# EAGLE design RemoteR2.0 (EAGLE 9.6.2)
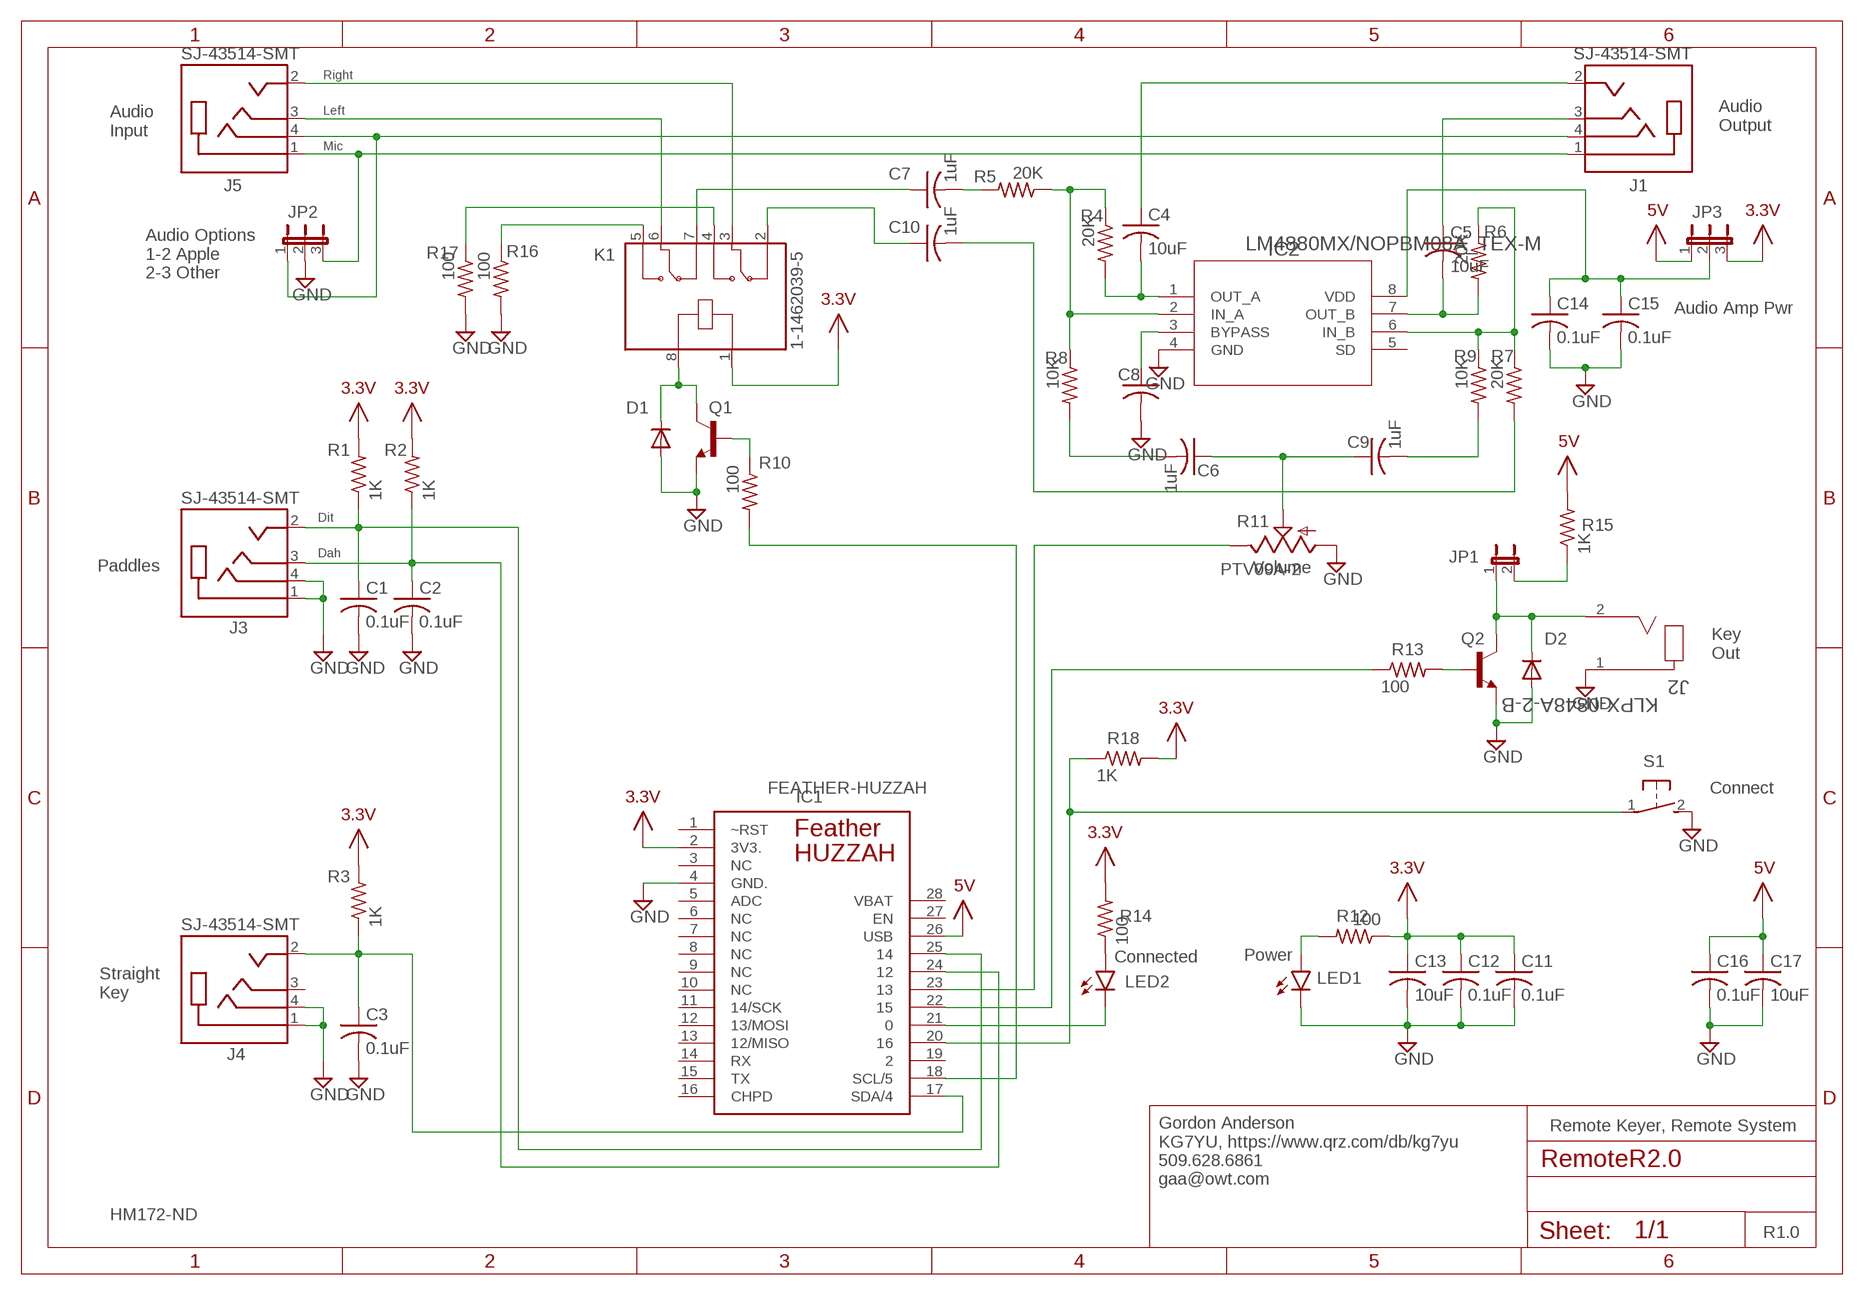
[diagram p0: schematic, sheet 1]

## Parts
C1  0.1uF  C-USC0805  [C0805]
C2  0.1uF  C-USC0805  [C0805]
C3  0.1uF  C-USC0805  [C0805]
C4  10uF  C-USC1206  [C1206]
C5  10uF  C-USC1206  [C1206]
C6  1uF  C-USC0805  [C0805]
C7  1uF  C-USC0805  [C0805]
C8  C-USC0805  [C0805]
C9  1uF  C-USC0805  [C0805]
C10  1uF  C-USC0805  [C0805]
C11  0.1uF  C-USC0805  [C0805]
C12  0.1uF  C-USC0805  [C0805]
C13  10uF  C-USC0805  [C0805]
C14  0.1uF  C-USC0805  [C0805]
C15  0.1uF  C-USC0805  [C0805]
C16  0.1uF  C-USC0805  [C0805]
C17  10uF  C-USC0805  [C0805]
D1  DIODE-SOD323-R  [SOD323-R]
D2  DIODE-SOD323-R  [SOD323-R]
IC1  FEATHER-HUZZAH  [FEATHER-HUZZAH]
IC2  LM4880MX/NOPBM08A_TEX-M  [M08A_TEX-M]
J1  SJ-43514-SMT  [CUI_SJ-43514-SMT]
J2  KLPX-0848A-2-B  [KLPX-0848A-2-B_KYC]
J3  SJ-43514-SMT  [CUI_SJ-43514-SMT]
J4  SJ-43514-SMT  [CUI_SJ-43514-SMT]
J5  SJ-43514-SMT  [CUI_SJ-43514-SMT]
JP1  JP1E  [JP1]
JP2  JP2E  [JP2]
JP3  JP2E  [JP2]
K1  1-1462039-5  [RELAY_1-1462039-5]
LED1  LED5MM  [LED5MM]
LED2  LED5MM  [LED5MM]
Q1  MMBT2369LT1-NPN-SOT23-BEC  [SOT23-BEC]
Q2  MMBT2369LT1-NPN-SOT23-BEC  [SOT23-BEC]
R1  1K  R-US_R0805  [R0805]
R2  1K  R-US_R0805  [R0805]
R3  1K  R-US_R0805  [R0805]
R4  20K  R-US_R0805  [R0805]
R5  20K  R-US_R0805  [R0805]
R6  20K  R-US_R0805  [R0805]
R7  20K  R-US_R0805  [R0805]
R8  10K  R-US_R0805  [R0805]
R9  10K  R-US_R0805  [R0805]
R10  100  R-US_R0805  [R0805]
R11  PTV09A-2  [PTV09A-2]
R12  100  R-US_R0805  [R0805]
R13  100  R-US_R0805  [R0805]
R14  100  R-US_R0805  [R0805]
R15  1K  R-US_R0805  [R0805]
R16  100  R-US_R1206  [R1206]
R17  100  R-US_R1206  [R1206]
R18  1K  R-US_R0805  [R0805]
S1  31-XX  [B3F-31XX]

## Nets
3.3V: C11.1 C12.1 C13.1 IC1.2(3V3.) JP3.3 K1.1 R1.2 R2.2 R3.2 R12.1 R14.2 R18.2
5V: C16.1 C17.1 IC1.26(USB) JP3.1 R15.2
GND: C1.2 C2.2 C3.2 C8.2 C11.2 C12.2 C13.2 C14.2 C15.2 C16.2 C17.2 D1.A D2.A IC1.4(GND.) IC2.4(GND) J2.1 J3.1(SLEEVE) J3.4(RING2) J4.1(SLEEVE) J4.4(RING2) JP2.2 LED1.K(C) Q1.E Q2.E R11.1(A) R16.2 R17.2 S1.2(S)
N$1: Q2.B R13.2
N$2: C2.1 IC1.24 J3.3(RING1) R2.1
N$3: C3.1 IC1.17(SDA/4) J4.2(TIP) R3.1
N$4: C1.1 IC1.25 J3.2(TIP) R1.1
N$5: C9.2 R9.2
N$6: C4.2 IC2.1(OUT_A) R4.2
N$7: IC2.2(IN_A) R4.1 R5.1 R8.1
N$8: C8.1 IC2.3(BYPASS)
N$9: C7.1 K1.7
N$10: C6.2 R8.2
N$11: C5.2 IC2.7(OUT_B) R6.2
N$12: IC2.6(IN_B) R6.1 R7.1 R9.1
N$13: C6.1 C9.1 R11.2(S)
N$14: Q1.B R10.1
N$15: C4.1 J1.2(TIP)
N$16: C5.1 J1.3(RING1)
N$17: J5.3(RING1) K1.6
N$18: J5.2(TIP) K1.3
N$19: J1.1(SLEEVE) J5.1(SLEEVE) JP2.3
N$20: C7.2 R5.2
N$21: C10.1 K1.2
N$22: C10.2 R7.2
N$23: LED1.A R12.2
N$24: LED2.A R14.1
N$25: IC1.21 LED2.K(C)
N$26: IC1.23 R11.3(E)
N$27: IC1.22 R13.1
N$28: IC1.18(SCL/5) R10.2
N$29: JP1.2 R15.1
N$30: K1.4 R17.1
N$31: K1.5 R16.1
N$32: IC1.20 R18.1 S1.1(P)
N$33: C14.1 C15.1 IC2.8(VDD) JP3.2
N$34: J1.4(RING2) J5.4(RING2) JP2.1
RELAY-: D2.C J2.2 JP1.1 Q2.C
RELAY-1: D1.C K1.8 Q1.C
Unconnected: IC1.1(~RST) IC1.3(NC) IC1.5(ADC) IC1.6(NC) IC1.7(NC) IC1.8(NC) IC1.9(NC) IC1.10(NC) IC1.11(14/SCK) IC1.12(13/MOSI) IC1.13(12/MISO) IC1.14(RX) IC1.15(TX) IC1.19 IC1.27(EN) IC2.5(SD) J4.3(RING1)

## Notes on the sheet
- Right
- Left
- Audio
  Output
- Audio
  Input
- Mic
- Audio Options
  1-2 Apple
  2-3 Other
- Audio Amp Pwr
- Dit
- Dah
- Paddles | Volume
- Key
  Out
- Connect
- Connected | Power
- Straight
  Key
- Remote Keyer, Remote System
- Gordon Anderson
  KG7YU, https://www.qrz.com/db/kg7yu
  509.628.6861
  gaa@owt.com
- HM172-ND
- R1.0

## Power pins joined to a net without a drawn wire
CHPD: IC1.16(CHPD)
VBAT: IC1.28(VBAT)

## Library data of the parts
C1-C17 = rcl:C-US: CAPACITOR, American symbol; SPICEPREFIX: C
D1 D2 = diode:DIODE-: DIODE
IC1 = GAAextensions:FEATHER-HUZZAH
IC2 = GAAextensions:LM4880MX/NOPB; COPYRIGHT: Copyright (C) 2021 Ultra Librarian. All rights reserved.; DIGI-KEY_PART_NUMBER_1: 296-35421-1-ND; DIGI-KEY_PART_NUMBER_2: 296-35421-2-ND; DIGI-KEY_PART_NUMBER_3: 296-35421-6-ND; MANUFACTURER_PART_NUMBER: LM4880MX/NOPB; MFR_NAME: Texas Instruments
J1 J3-J5 = SJ-43514-SMT:SJ-43514-SMT: 4 conductor 3.5 mm Surface Mount Audio Jack; CUI_PURCHASE_URL: https://www.cuidevices.com/product/interconnect/connectors/audio-connectors/jacks/sj-4351x-smt-series?utm_source=snapeda.com&utm_medium=referral&utm_campaign=snapedaBOM; DESCRIPTION: 3.5 mm, 4 Conductors, Right Angle, Surface Mount (SMT), Audio Jack Connector; MF: CUI Devices; MP: SJ-43514-SMT-TR; PACKAGE: None; PURCHASE-URL: https://pricing.snapeda.com/search/part/SJ-43514-SMT-TR/?ref=eda
J2 = GAAextensions:KLPX-0848A-2-B; COPYRIGHT: Copyright (C) 2021 Ultra Librarian. All rights reserved.; DIGI-KEY_PART_NUMBER_1: 2092-KLPX-0848A-2-B-ND; MANUFACTURER_PART_NUMBER: KLPX-0848A-2-B; MFR_NAME: KYCON, INC.
JP1 = jumper:JP1E: JUMPER
JP2 JP3 = jumper:JP2E: JUMPER
K1 = 1-1462039-5:1-1462039-5: Signal Relay 3VDC 2A DPDT( (10mm 6mm 5.65mm)) THT Automotive; COMMENT: 1-1462039-5; DESCRIPTION: Signal Relay 3VDC 2A DPDT( (10mm 6mm 5.65mm)) THT Automotive; DIGI-KEY_PART_NUMBER: PB1167-ND; EU_ROHS_COMPLIANCE: Compliant; MF: TE Connectivity; MP: 1-1462039-5; PACKAGE: None; PURCHASE-URL: https://pricing.snapeda.com/search/part/1-1462039-5/?ref=eda
LED1 LED2 = led:LED: LED OSRAM: - CHIPLED LG R971, LG N971, LY N971, LG Q971, LY Q971, LO R971, LY R971 LH N974, LH R974 LS Q976, LO Q976, LY Q976 LO Q996 - Hyper CHIPLED LW Q18S LB Q993, LB Q99A, LB R99A - SideLED LS A670, LO A670, LY A670, LG A670, LP A670 LB A673, LV A673, LT A673, LW A673 LH A674 LY A675 LS A676, LA A676, LO A676, LY A676, LW A676 LS A679, LY A679, LG A679 - Hyper Micro SIDELED® LS Y876, LA Y876, LO Y876, LY Y876 LT Y87S - SmartLED LW L88C, LW L88S LB L89C, LB L89S, LG L890 LS L89K, LO L89K, LY L89K LS L896, LA L896, LO L896, LY L896 - TOPLED LS T670, LO T670, LY T670, LG T670, LP T670 LSG T670, LSP T670, LSY T670, LOP T670, LYG T670 LG T671, LOG T671, LSG T671 LB T673, LV T673, LT T673, LW T673 LH T674 LS T676, LA T676, LO T676, LY T676, LB T676, LH T676, LSB T676, LW T676 LB T67C, LV T67C, LT T67C, LS T67K, LO T67K, LY T67K, LW E67C LS E67B, LA E67B, LO E67B, LY E67B, LB E67C, LV E67C, LT E67C LW T67C LS T679, LY T679, LG T679 LS T770, LO T770, LY T770, LG T770, LP T770 LB T773, LV T773, LT T773, LW T773 LH T774 LS E675, LA E675, LY E675, LS T675 LS T776, LA T776, LO T776, LY T776, LB T776 LHGB T686 LT T68C, LB T68C - Hyper Mini TOPLED® LB M676 - Mini TOPLED Santana® LG M470 LS M47K, LO M47K, LY M47K Source: http://www.osram.convergy.de LUXEON: - LUMILED® LXK2-PW12-R00, LXK2-PW12-S00, LXK2-PW14-U00, LXK2-PW14-V00 LXK2-PM12-R00, LXK2-PM12-S00, LXK2-PM14-U00 LXK2-PE12-Q00, LXK2-PE12-R00, LXK2-PE12-S00, LXK2-PE14-T00, LXK2-PE14-U00 LXK2-PB12-K00, LXK2-PB12-L00, LXK2-PB12-M00, LXK2-PB14-N00, LXK2-PB14-P00, LXK2-PB14-Q00 LXK2-PR12-L00, LXK2-PR12-M00, LXK2-PR14-Q00, LXK2-PR14-R00 LXK2-PD12-Q00, LXK2-PD12-R00, LXK2-PD12-S00 LXK2-PH12-R00, LXK2-PH12-S00 LXK2-PL12-P00, LXK2-PL12-Q00, LXK2-PL12-R00 Source: www.luxeon.com KINGBRIGHT: KA-3528ASYC Source: www.kingbright.com
Q1 Q2 = GAAextensions:*-NPN-: NPN Transistror
R1-R10 R12-R18 = rcl:R-US_: RESISTOR, American symbol; SPICEPREFIX: R
R11 = GAAextensions:PTV09A-2
S1 = switch-omron:31-XX: OMRON SWITCH; MPN: B3F-3100; OC_FARNELL: 959704; OC_NEWARK: 36M3582

## Board
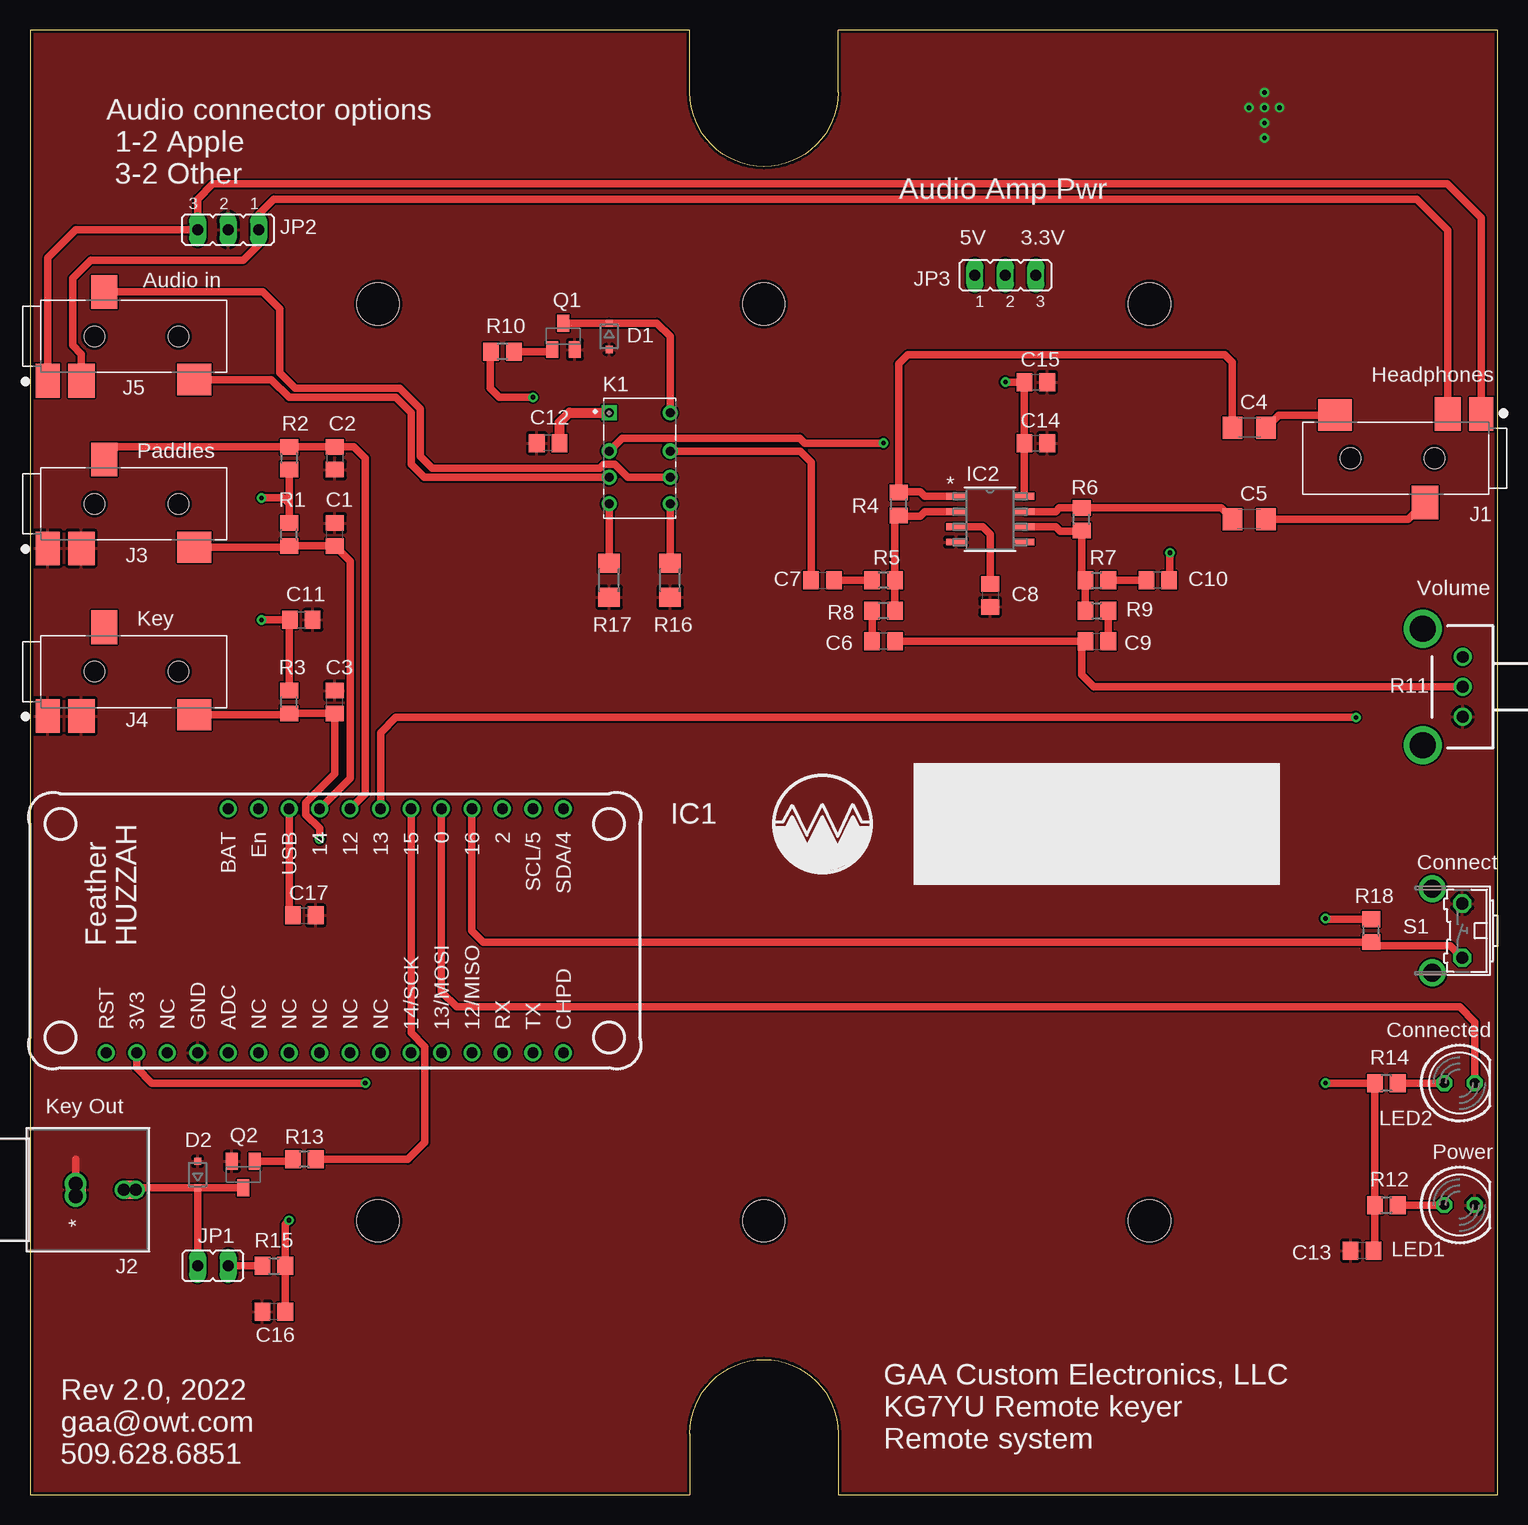
[diagram p1: board, top side]
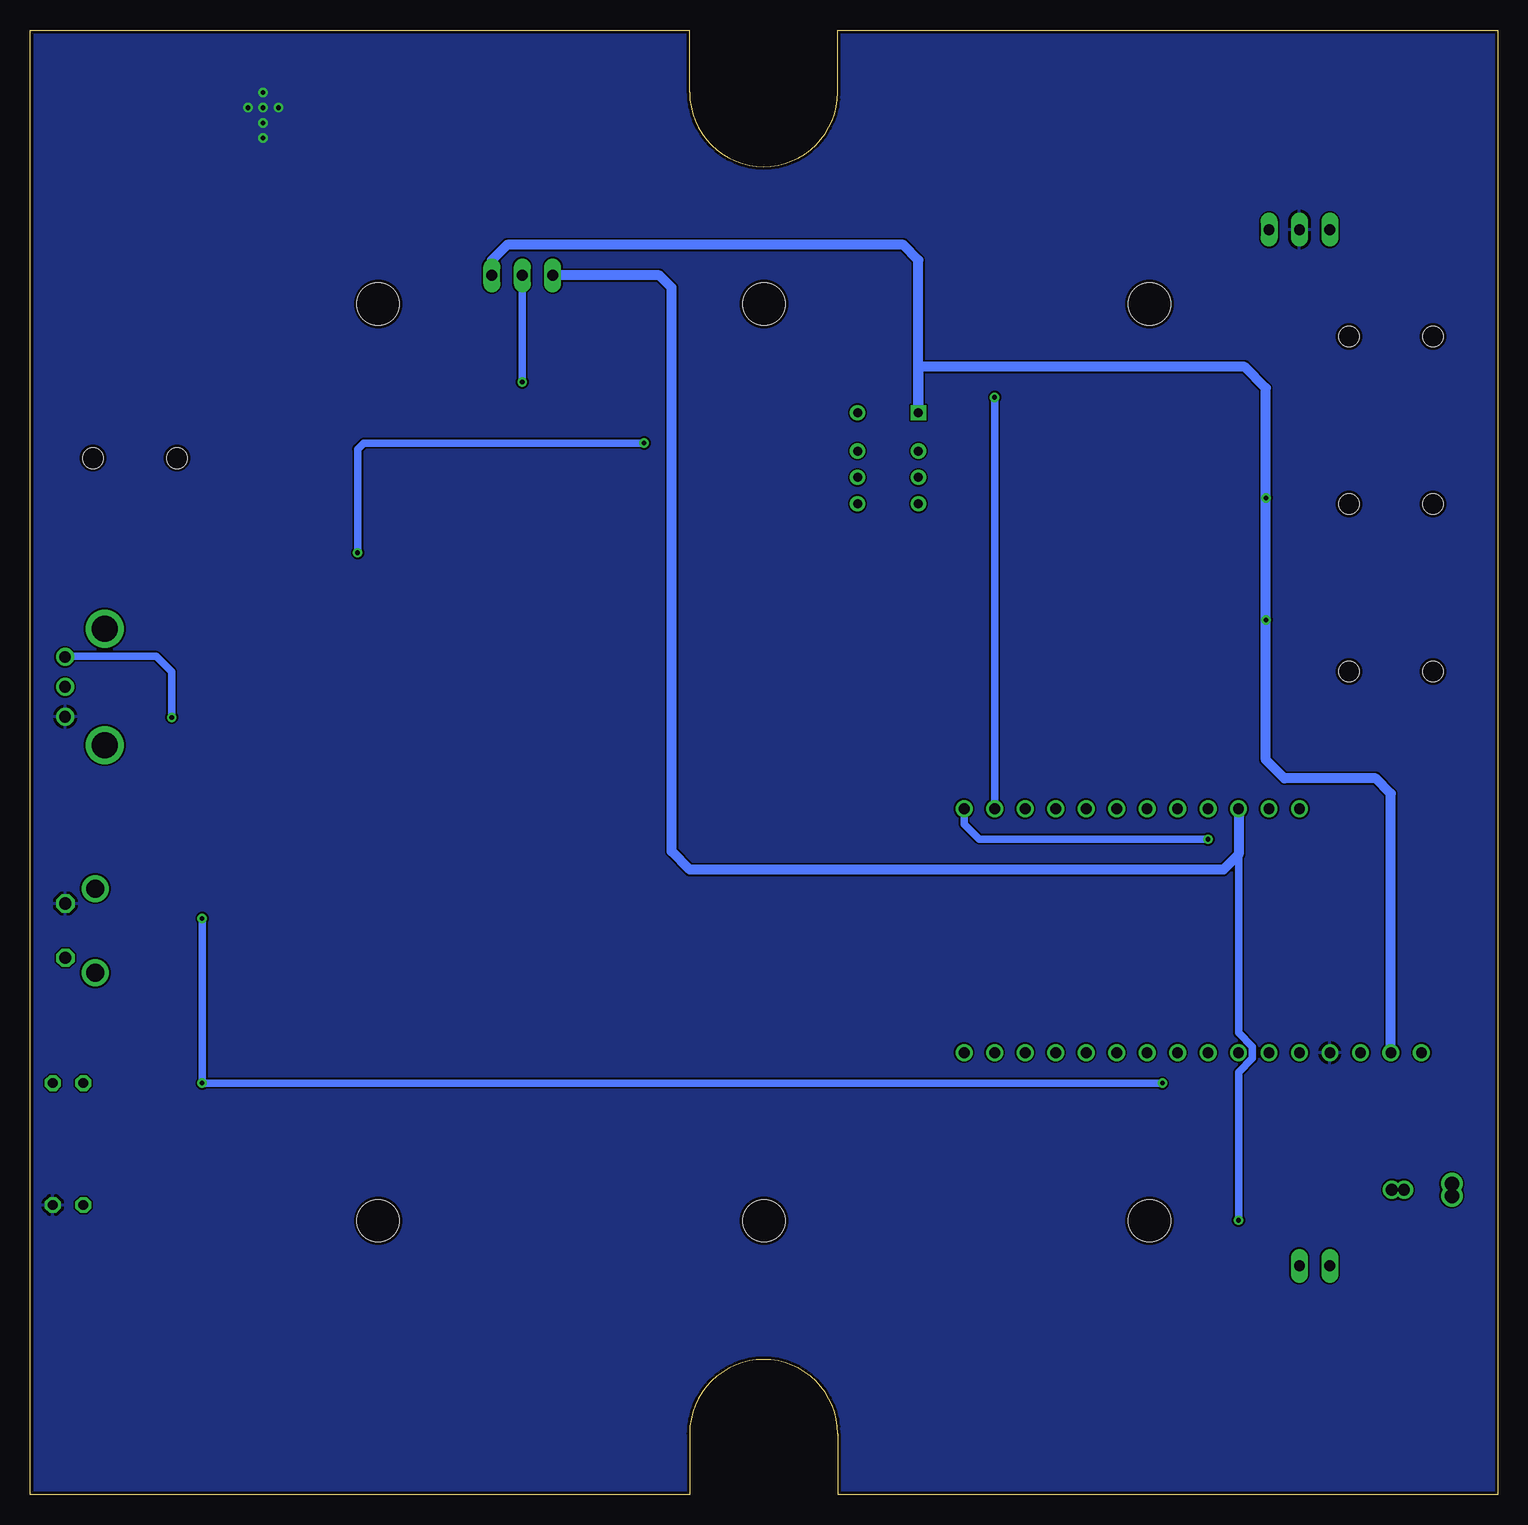
[diagram p2: board, bottom side, seen from below]

Size 122.3 x 122.05 mm. Coordinates in mm from the lower left corner, seen from the top.
Outline: 0,0 54.99,0 54.99,5.08 arc-180 67.33,5.08 67.33,0 122.3,0 122.3,122.05 67.33,122.05 67.33,116.84 arc-180 54.99,116.84 54.99,122.05 0,122.05 0,0
Copper layers (1*16): Top 0.035mm / dielectric 1.5mm / Bottom 0.035mm
Design rules "default *": minimum track width 6mil, minimum drill 0.35mm, track to track 6mil, track to pad 6mil, pad to pad 6mil, via to via 6mil, smd to smd 6mil, copper to edge 10mil, drill to drill 6mil, minimum pad ring 10mil, minimum via ring 8mil, stop-mask expansion 4mil, vias tented up to drill 50mil, thermal gap 10mil
Holes 3.51 mm at 29.01,22.81 61.14,22.81 93.29,22.81 29.01,99.21 61.14,99.21 93.29,99.21

### Footprints (pad centres in the part's own frame; a part is rotated, then mirrored left to right if it is on the bottom)
C0805 = smd 1.3 x 1.5: 1 -0.95,0; 2 0.95,0
C1206 = smd 1.6 x 1.8: 1 -1.4,0; 2 1.4,0
SOD323-R = smd 0.6 x 0.6: A 1.1,0; C -1.1,0
FEATHER-HUZZAH = drill 0.9: 1 -10.16,17.78; 2 -10.16,15.24; 3 -10.16,12.7; 4 -10.16,10.16; 5 -10.16,7.62; 6 -10.16,5.08; 7 -10.16,2.54; 8 -10.16,0; 9 -10.16,-2.54; 10 -10.16,-5.08; 11 -10.16,-7.62; 12 -10.16,-10.16; 13 -10.16,-12.7; 14 -10.16,-15.24; 15 -10.16,-17.78; 16 -10.16,-20.32; 17 10.16,-20.32; 18 10.16,-17.78; 19 10.16,-15.24; 20 10.16,-12.7; 21 10.16,-10.16; 22 10.16,-7.62; 23 10.16,-5.08; 24 10.16,-2.54; 25 10.16,0; 26 10.16,2.54; 27 10.16,5.08; 28 10.16,7.62
M08A_TEX-M = smd 1.664 x 0.559: 1 -2.826,1.905; 2 -2.826,0.635; 3 -2.826,-0.635; 4 -2.826,-1.905; 5 2.826,-1.905; 6 2.826,-0.635; 7 2.826,0.635; 8 2.826,1.905
CUI_SJ-43514-SMT = smd 2 x 2.8: 1 -7.15,-3.7 | smd 2.8 x 2.6: 2 5.05,-3.6 | smd 2.2 x 2.8: 3 -2.45,3.7; 4 -4.35,-3.7 | hole 1.7: -3.25,0; 3.75,0
KLPX-0848A-2-B_KYC = smd 2.718 x 1.702: 1 0,0 | smd 1.499 x 2.515: 2 0,-4.5 | drill 1.194 pad 1.194: S_1_H1 0.508,0; S_1_H2 -0.508,0 | drill 0.991 pad 0.991: S_2_H1 0,-3.988; S_2_H2 0,-5.004
JP1 = drill 0.914 long: 1 0,-1.27; 2 0,1.27
JP2 = drill 0.914 long: 1 -2.54,0; 2 0,0; 3 2.54,0
RELAY_1-1462039-5 = drill 0.75 square: 1 -2.54,3.8 | drill 0.75: 2 -2.54,0.6; 3 -2.54,-1.6; 4 -2.54,-3.8; 5 2.54,-3.8; 6 2.54,-1.6; 7 2.54,0.6; 8 2.54,3.8
LED5MM = drill 0.813 octagon: A -1.27,0; K 1.27,0
SOT23-BEC = smd 1 x 1.4: B -0.95,-1.1; C 0,1.1; E 0.95,-1.1
R0805 = smd 1.3 x 1.5: 1 -0.95,0; 2 0.95,0
PTV09A-2 = drill 0.991: 1 -2.489,0; 2 0,0; 3 2.489,0 | drill 2.159: S1 -4.851,3.302; S2 4.851,3.302
R1206 = smd 1.6 x 1.803: 1 -1.422,0; 2 1.422,0
B3F-31XX = drill 1.016 octagon: 1 -2.261,-1.245; 2 2.261,-1.245 | drill 1.499 pad 2.159: 3 -3.505,1.245; 4 3.505,1.245

### Placement (x,y rotation side)
C1  25.4,80.01 90 top
C2  25.4,86.36 270 top
C3  25.4,66.04 90 top
C4  101.6,88.9 180 top
C5  101.6,81.28 180 top
C6  71.12,71.12 180 top
C7  66.04,76.2 0 top
C8  80.01,74.93 270 top
C9  88.9,71.12 0 top
C10  93.98,76.2 180 top
C11  22.61,72.9 0 top
C12  43.18,87.63 180 top
C13  111,20.32 180 top
C14  83.82,87.63 0 top
C15  83.82,92.71 0 top
C16  20.32,15.24 180 top
C17  22.86,48.26 0 top
D1  48.26,96.52 270 top
D2  13.97,26.67 90 top
IC1  24.13,46.99 90 top
IC2  80.01,81.28 0 top
J1  113.79,86.36 180 top
J2  3.81,25.4 90 top
J3  8.64,82.55 0 top
J4  8.64,68.58 0 top
J5  8.64,96.52 0 top
JP1  15.24,19.05 270 top
JP2  16.51,105.41 180 top
JP3  81.28,101.6 0 top
K1  50.8,86.36 0 top
LED1  119.13,24.13 0 top
LED2  119.13,34.29 0 top
Q1  44.45,96.52 0 top
Q2  17.78,26.67 180 top
R1  21.59,80.01 90 top
R2  21.59,86.36 270 top
R3  21.59,66.04 90 top
R4  72.39,82.55 90 top
R5  71.12,76.2 180 top
R6  87.63,81.28 90 top
R7  88.9,76.2 0 top
R8  71.12,73.66 180 top
R9  88.9,73.66 0 top
R10  39.37,95.25 180 top
R11  119.38,67.31 90 top
R12  113.03,24.13 0 top
R13  22.86,27.94 180 top
R14  113.03,34.29 180 top
R15  20.32,19.05 0 top
R16  53.34,76.2 270 top
R17  48.26,76.2 270 top
R18  111.76,46.99 90 top
S1  118.11,46.99 90 top
U$1  [LOGO2]  66.04,55.88 0 top

### Tracks (layer width: path | path; a pad name or v marks a point on that pad's centre or on a via)
3.3V  (via drill 0.38)
  Top 0.61: C13.1 112.08,20.45 R12.1 R14.2 v107.95,34.29 | R2.2 21.59,82.55 | 21.59,82.55 R1.2 | IC1.2 8.89,35.56 10.16,34.29 v27.94,34.29 | R18.2 108.02,47.94 v107.95,48.01 | R3.2 21.59,72.83 | 21.59,72.83 C11.1 | 21.59,82.55 21.08,83.06 v19.3,83.06 | v19.3,72.9 21.52,72.9 21.59,72.83
  Top 0.813: C12.1 44.13,89.34 44.96,90.17 K1.1
  Bottom 0.61: v27.94,34.29 v107.95,34.29 v107.95,48.01
  Bottom 0.813: IC1.2 8.89,58.42 10.16,59.69 17.78,59.69 19.3,61.21 v19.3,72.9 v19.3,83.06 19.3,92.2 21.08,93.98 48.26,93.98 K1.1 48.26,102.87 49.53,104.14 82.55,104.14 83.82,102.87 JP3.3
5V  (via drill 0.38)
  Top 0.61: C16.1 R15.2 21.27,22.54 v21.59,22.86 | IC1.26 21.59,48.58 C17.1
  Bottom 0.61: v21.59,22.86 21.59,35.19 20.43,36.35 20.43,37.31 21.59,38.47 IC1.26
  Bottom 0.813: IC1.26 21.59,53.34 22.86,52.07 67.31,52.07 68.83,53.59 68.83,100.58 69.85,101.6 JP3.1
GND  (via drill 0.38)
  Top 0.61: J2.1 3.81,27.94
  other vias: 102.87,115.57 102.87,116.84 102.87,114.3 102.87,113.03 101.6,115.57 104.14,115.57
  pour Top: 0,121.92 123.19,121.92 123.19,0 0,0
  pour Bottom: 0,121.92 121.92,121.92 121.92,0 0,0
N$1
  Top 0.61: Q2.B 21.74,27.77 R13.2
N$2
  Top 0.61: J3.3 7.25,87.31 R2.1 C2.1 26.99,87.31 27.94,86.36 27.94,58.42 IC1.24
N$3  (via drill 0.38)
  Top 0.61: J4.2 21.48,64.98 R3.1 C3.1 25.4,60.06 22.97,57.63 22.97,56.67 24.13,55.51 v24.13,54.61
  Bottom 0.61: v24.13,54.61 43.18,54.61 44.45,55.88 IC1.17
N$4
  Top 0.61: J3.2 21.48,78.95 R1.1 C1.1 26.67,77.79 26.67,59.69 IC1.25
N$5
  Top 0.61: C9.2 R9.2
N$6
  Top 0.61: IC2.1 74.55,83.19 74.17,83.57 72.46,83.57 R4.2 72.39,94.23 73.15,95 99.57,95 100.2,94.36 C4.2
N$7
  Top 0.61: IC2.2 74.55,81.92 74.17,81.53 72.46,81.53 | 72.46,81.53 R4.1 | R8.1 R5.1 72.07,81.15 72.46,81.53
N$8
  Top 0.61: IC2.3 79.38,80.64 80.01,80.01 C8.1
N$9
  Top 0.61: K1.7 64.17,86.96 65.09,86.04 C7.1
N$10
  Top 0.61: C6.2 R8.2
N$11
  Top 0.61: IC2.7 85.47,81.92 85.79,82.23 R6.2 99.25,82.23 C5.2
N$12
  Top 0.61: R9.1 R7.1 87.63,76.52 R6.1 87.56,80.26 85.85,80.26 85.47,80.64 IC2.6
N$13
  Top 0.61: C9.1 87.63,71.12 | 87.63,71.12 C6.1 | R11.2 88.65,67.31 87.63,68.33 87.63,71.12
N$14
  Top 0.61: Q1.B 43.33,95.25 R10.1
N$15
  Top 0.61: J1.2 104.06,89.96 C4.1
N$16
  Top 0.61: C5.1 114.86,81.28 J1.3
N$17
  Top 0.61: J5.3 19.41,100.22 20.83,98.81 20.83,93.47 22.1,92.2 30.8,92.2 32.51,90.49 32.51,86.54 33.53,85.52 47.49,85.52 47.81,85.85 48.71,85.85 49.8,84.76 K1.6
N$18
  Top 0.61: J5.2 20.11,92.92 21.59,91.44 30.48,91.44 31.75,90.17 31.75,85.85 32.84,84.76 K1.3
N$19
  Top 0.61: J5.1 1.49,103.09 3.81,105.41 JP2.3 13.97,107.95 15.24,109.22 118.11,109.22 120.94,106.39 J1.1
N$20
  Top 0.61: R5.2 C7.2
N$21  (via drill 0.38)
  Top 0.61: v71.12,87.63 64.58,87.63 64.16,88.05 49.35,88.05 K1.2 | v95,78.49 95,76.27 C10.1
  Bottom 0.61: v71.12,87.63 94.49,87.63 95,87.12 v95,78.49
N$22
  Top 0.61: R7.2 C10.2
N$23
  Top 0.61: R12.2 LED1.A
N$24
  Top 0.61: R14.1 LED2.A
N$25
  Top 0.61: IC1.21 34.29,41.91 35.56,40.64 119.13,40.64 120.4,39.37 LED2.K
N$26  (via drill 0.38)
  Top 0.61: IC1.23 29.21,63.5 30.48,64.77 v110.49,64.77
  Bottom 0.61: v110.49,64.77 110.49,68.58 111.76,69.85 119.33,69.85 R11.3
N$27
  Top 0.61: IC1.22 31.75,38.47 32.91,37.31 32.91,29.36 31.5,27.94 R13.1
N$28  (via drill 0.38)
  Top 0.61: v41.91,91.44 39.12,91.44 38.35,92.2 38.35,95.18 R10.2
  Bottom 0.61: IC1.18 v41.91,91.44
N$29
  Top 0.61: JP1.2 R15.1
N$30
  Top 0.61: K1.4 R17.1
N$31
  Top 0.61: K1.5 R16.1
N$32
  Top 0.61: S1.1 118.36,45.72 112.08,45.72 R18.1 37.78,46.04 36.83,46.99 IC1.20
N$33  (via drill 0.38)
  Top 0.61: IC2.8 82.84,87.6 C14.1 C15.1 v81.28,92.71
  Bottom 0.61: v81.28,92.71 JP3.2
N$34
  Top 0.61: J5.4 4.29,95.03 3.56,95.76 3.56,101.35 5.08,102.87 17.78,102.87 19.05,104.14 JP2.1 19.05,106.68 20.32,107.95 115.57,107.95 118.14,105.38 J1.4
RELAY-
  Top 0.61: D2.C JP1.1 | J2.2 8.48,25.57 D2.C | D2.C Q2.C 17.78,25.4
RELAY-1
  Top 0.61: Q1.C D1.C 52.24,97.62 53.34,96.52 K1.8

### Text on the board
tPlace: Audio connector options / 1-2 Apple / 3-2 Other | Audio Amp Pwr | 5V | 3.3V | Audio in | Headphones | Paddles | Volume | Key | Connect | Connected | Key Out | Power | GAA Custom Electronics, LLC / KG7YU Remote keyer / Remote system | Rev 2.0, 2022 / gaa@owt.com / 509.628.6851